# EAGLE schematic main-stm-02.2 (EAGLE 7.6.0)
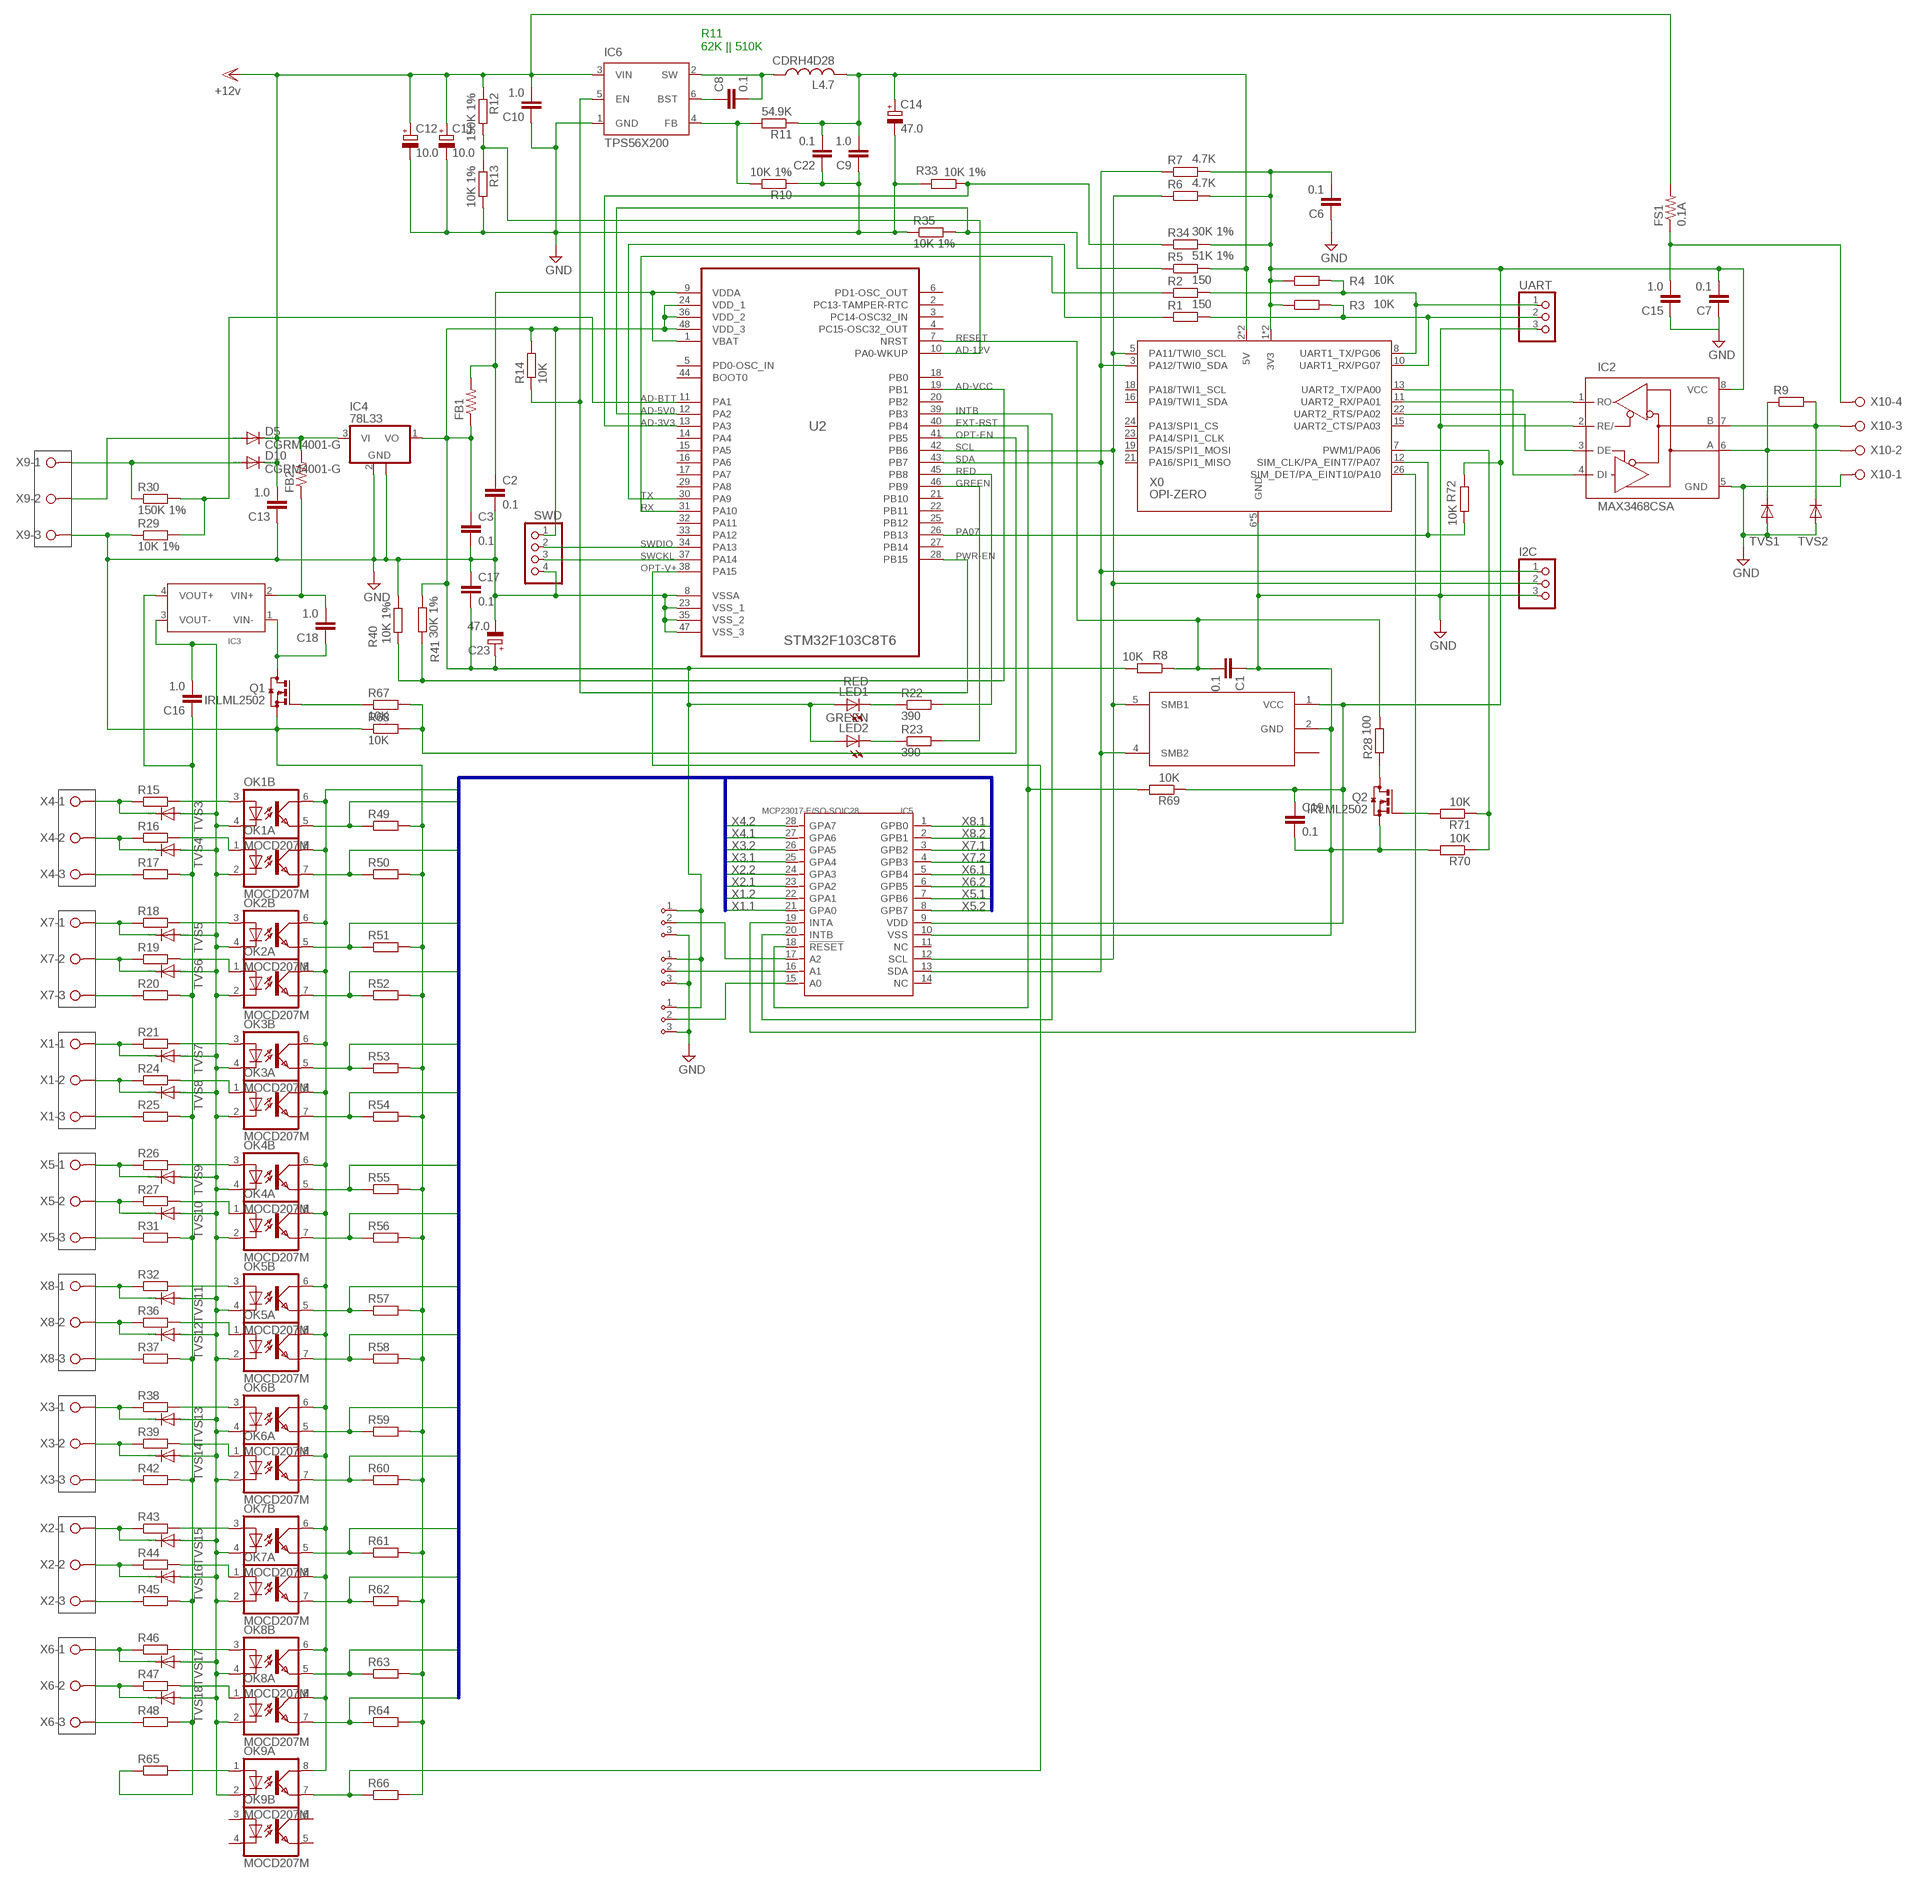
[diagram p0: schematic, sheet 1]

## Parts
A0  ADDR3PIN0603  [0603-3PIN]
A1  ADDR3PIN0603  [0603-3PIN]
A2  ADDR3PIN0603  [0603-3PIN]
C1  0.1  C-EUC0603  [C0603]
C2  0.1  C-EUC0603  [C0603]
C3  0.1  C-EUC0603  [C0603]
C6  0.1  C-EUC0805  [C0805]
C7  0.1  C-EUC0805  [C0805]
C8  0.1  C-EUC0805  [C0805]
C9  1.0  C-EUC0805  [C0805]
C10  1.0  C-EUC1206  [C1206]
C11  10.0  CPOL-EUC/6032-28R  [C/6032-28R]
C12  10.0  CPOL-EUC/6032-28R  [C/6032-28R]
C13  1.0  C-EUC1206  [C1206]
C14  47.0  CPOL-EUB/3528-21R  [B/3528-21R]
C15  1.0  C-EUC1206  [C1206]
C16  1.0  C-EUC1206  [C1206]
C17  0.1  C-EUC0603  [C0603]
C18  1.0  C-EUC1206  [C1206]
C19  0.1  C-EUC0603  [C0603]
C22  0.1  C-EUC0805  [C0805]
C23  47.0  CPOL-EUB/3528-21R  [B/3528-21R]
D5  CGRM4001-G  [SOD-123_MINI-SMA]
D10  CGRM4001-G  [SOD-123_MINI-SMA]
FB1  R-US_R0805  [R0805]
FB2  R-US_R1206  [R1206]
FS1  0.1A  R-US_R1210  [R1210]
I2C  PINHD-1X3  [1X03]
IC2  MAX3468CSA  [SO08]
IC3  DC-DC-CONV-4PIN-ISOLATINGMURATA-NME-05-12-SERIES  [DC-DC-MURATA-NME-05-12-SERIES]
IC4  78L33  78L05F  [SOT89]
IC5  MCP23017-E/SO-SOIC28  INTERFACE-MCP23017-E(SOIC28)  [SOIC28-1.27-17.9X7.5MM]
IC6  TPS56X200  [TSOT23-6_DDC]
IC7  LTC1694  [SOT23-5]
L4.7  CDRH4D28  [CDRH4D28]
LED1  RED  LEDCHIPLED_1206  [CHIPLED_1206]
LED2  GREEN  LEDCHIPLED_1206  [CHIPLED_1206]
OK1  MOCD207M  [SOIC08-FAIRCHILD]
OK2  MOCD207M  [SOIC08-FAIRCHILD]
OK3  MOCD207M  [SOIC08-FAIRCHILD]
OK4  MOCD207M  [SOIC08-FAIRCHILD]
OK5  MOCD207M  [SOIC08-FAIRCHILD]
OK6  MOCD207M  [SOIC08-FAIRCHILD]
OK7  MOCD207M  [SOIC08-FAIRCHILD]
OK8  MOCD207M  [SOIC08-FAIRCHILD]
OK9  MOCD207M  [SOIC08-FAIRCHILD]
Q1  IRLML2502  [SOT23]
Q2  IRLML2502  [SOT23]
R1  150  R-EU_R0603  [R0603]
R2  150  R-EU_R0603  [R0603]
R3  10K  R-EU_R0603  [R0603]
R4  10K  R-EU_R0603  [R0603]
R5  51K 1%  R-EU_R0603  [R0603]
R6  4.7K  R-EU_R0603  [R0603]
R7  4.7K  R-EU_R0603  [R0603]
R8  10K  R-EU_R0603  [R0603]
R9  R-EU_R1206  [R1206]
R10  10K 1%  R-EU_R0603  [R0603]
R11  54.9K  R-EU_R0603  [R0603]
R12  150K 1%  R-EU_R0603  [R0603]
R13  10K 1%  R-EU_R0603  [R0603]
R14  10K  R-EU_R0603  [R0603]
R15  R-EU_R0603  [R0603]
R16  R-EU_R0603  [R0603]
R17  R-EU_R0603  [R0603]
R18  R-EU_R0603  [R0603]
R19  R-EU_R0603  [R0603]
R20  R-EU_R0603  [R0603]
R21  R-EU_R0603  [R0603]
R22  390  R-EU_R0603  [R0603]
R23  390  R-EU_R0603  [R0603]
R24  R-EU_R0603  [R0603]
R25  R-EU_R0603  [R0603]
R26  R-EU_R0603  [R0603]
R27  R-EU_R0603  [R0603]
R28  100  R-EU_R0603  [R0603]
R29  10K 1%  R-EU_R0603  [R0603]
R30  150K 1%  R-EU_R0603  [R0603]
R31  R-EU_R0603  [R0603]
R32  R-EU_R0603  [R0603]
R33  10K 1%  R-EU_R0603  [R0603]
R34  30K 1%  R-EU_R0603  [R0603]
R35  10K 1%  R-EU_R0603  [R0603]
R36  R-EU_R0603  [R0603]
R37  R-EU_R0603  [R0603]
R38  R-EU_R0603  [R0603]
R39  R-EU_R0603  [R0603]
R40  10K 1%  R-EU_R0603  [R0603]
R41  30K 1%  R-EU_R0603  [R0603]
R42  R-EU_R0603  [R0603]
R43  R-EU_R0603  [R0603]
R44  R-EU_R0603  [R0603]
R45  R-EU_R0603  [R0603]
R46  R-EU_R0603  [R0603]
R47  R-EU_R0603  [R0603]
R48  R-EU_R0603  [R0603]
R49  R-EU_R0603  [R0603]
R50  R-EU_R0603  [R0603]
R51  R-EU_R0603  [R0603]
R52  R-EU_R0603  [R0603]
R53  R-EU_R0603  [R0603]
R54  R-EU_R0603  [R0603]
R55  R-EU_R0603  [R0603]
R56  R-EU_R0603  [R0603]
R57  R-EU_R0603  [R0603]
R58  R-EU_R0603  [R0603]
R59  R-EU_R0603  [R0603]
R60  R-EU_R0603  [R0603]
R61  R-EU_R0603  [R0603]
R62  R-EU_R0603  [R0603]
R63  R-EU_R0603  [R0603]
R64  R-EU_R0603  [R0603]
R65  R-EU_R0603  [R0603]
R66  R-EU_R0603  [R0603]
R67  10K  R-EU_R0603  [R0603]
R68  10K  R-EU_R0603  [R0603]
R69  10K  R-EU_R0603  [R0603]
R70  10K  R-EU_R0603  [R0603]
R71  10K  R-EU_R0603  [R0603]
R72  10K  R-EU_R0603  [R0603]
SWD  PINHD-1X4  [1X04]
TVS1  DIODE-SOD323-W  [SOD323-W]
TVS2  DIODE-SOD323-W  [SOD323-W]
TVS3  DIODE-SOD323-W  [SOD323-W]
TVS4  DIODE-SOD323-W  [SOD323-W]
TVS5  DIODE-SOD323-W  [SOD323-W]
TVS6  DIODE-SOD323-W  [SOD323-W]
TVS7  DIODE-SOD323-W  [SOD323-W]
TVS8  DIODE-SOD323-W  [SOD323-W]
TVS9  DIODE-SOD323-W  [SOD323-W]
TVS10  DIODE-SOD323-W  [SOD323-W]
TVS11  DIODE-SOD323-W  [SOD323-W]
TVS12  DIODE-SOD323-W  [SOD323-W]
TVS13  DIODE-SOD323-W  [SOD323-W]
TVS14  DIODE-SOD323-W  [SOD323-W]
TVS15  DIODE-SOD323-W  [SOD323-W]
TVS16  DIODE-SOD323-W  [SOD323-W]
TVS17  DIODE-SOD323-W  [SOD323-W]
TVS18  DIODE-SOD323-W  [SOD323-W]
U2  STM32F103C8T6  STM32F100CBT6B  [QFP50P900X900X160-48N]
UART  PINHD-1X3  [1X03]
X0  OPI-ZERO  [OPI0]
X1  W237-03P  [W237-133]
X2  W237-03P  [W237-133]
X3  W237-03P  [W237-133]
X4  W237-03P  [W237-133]
X5  W237-03P  [W237-133]
X6  W237-03P  [W237-133]
X7  W237-03P  [W237-133]
X8  W237-03P  [W237-133]
X9  W237-03P  [W237-133]
X10  W237-04P  [W237-4P]

## Nets
12V [POWER]: C10.2 C11.+ C12.+ C13.2 D5.C D10.C FB2.2 FS1.2 IC4.3(VI) IC6.3(VIN) R12.1 ; supply symbol labelled +12v
AD-3V3: R33.1 R34.1 U2.13(PA3)
AD-5V0: R5.1 R35.2 U2.12(PA2)
AD-12V: R12.2 R13.1 U2.10(PA0-WKUP)
AD-BTT: R29.2 R30.2 U2.11(PA1)
AD-VCC: R40.2 R41.1 U2.19(PB1)
EXT-RST: IC5.18(!RESET) R69.2 U2.40(PB4)
GND [POWER]: A0.3 A1.3 A2.3 C1.1 C2.2 C3.2 C6.1 C7.1 C9.1 C10.1 C11.- C12.- C13.1 C14.- C15.1 C17.1 C19.2 C22.1 C23.- I2C.3 IC2.2(RE/) IC2.5(GND) IC4.2(GND) IC4.2@1(GND) IC5.10(VSS) IC6.1(GND) IC7.2(GND) Q1.2(S) Q2.2(S) R10.1 R13.2 R29.1 R33.2 R35.1 R40.1 R49.2 R50.2 R51.2 R52.2 R53.2 R54.2 R55.2 R56.2 R57.2 R58.2 R59.2 R60.2 R61.2 R62.2 R63.2 R64.2 R66.2 R68.1 R70.2 SWD.4 TVS1.A TVS2.A U2.8(VSSA) U2.23(VSS_1) U2.35(VSS_2) U2.47(VSS_3) UART.3 X0.6(GND) X0.9(GND) X0.14(GND) X0.20(GND) X0.25(GND) X9.3 X10.1
GREEN: R23.2 U2.46(PB9)
INTA: IC5.19(INTA) X0.26(SIM_DET/PA_EINT10/PA10)
INTB: IC5.20(INTB) U2.39(PB3)
N$1: IC2.3(DE) X0.22(UART2_RTS/PA02)
N$2: IC2.1(RO) X0.11(UART2_RX/PA01)
N$3 [POWER]: C8.2 IC6.2(SW) L4.7.P$1
N$4: Q2.3(D) R28.1
N$5: Q2.1(G) R71.2
N$9: IC2.4(DI) X0.13(UART2_TX/PA00)
N$12 [POWER]: D5.A X9.2
N$14: OK1.3(B:A) R15.2
N$17: C8.1 IC6.6(BST)
N$21: IC2.6(A) R9.1 TVS1.C X10.2
N$22: IC6.4(FB) R10.2 R11.2
N$23: IC2.7(B) R9.2 TVS2.C X10.3
N$24: C15.2 FS1.1 X10.4
N$26: R15.1 TVS3.C X4.1
N$28: R16.1 TVS4.C X4.2
N$30: R17.1 X4.3
N$31 [POWER]: D10.A R30.1 X9.1
N$32: R18.1 TVS5.C X7.1
N$33: R19.1 TVS6.C X7.2
N$34: R20.1 X7.3
N$35: OK2.3(B:A) R18.2
N$36: R21.1 TVS7.C X1.1
N$39: OK3.3(B:A) R21.2
N$40: R24.1 TVS8.C X1.2
N$41: R25.1 X1.3
N$42: R26.1 TVS9.C X5.1
N$43: R27.1 TVS10.C X5.2
N$44: R31.1 X5.3
N$45: R32.1 TVS11.C X8.1
N$46: R36.1 TVS12.C X8.2
N$47: R37.1 X8.3
N$48: R38.1 TVS13.C X3.1
N$49: R39.1 TVS14.C X3.2
N$50: R42.1 X3.3
N$51: R43.1 TVS15.C X2.1
N$52: R44.1 TVS16.C X2.2
N$53: R45.1 X2.3
N$54: R46.1 TVS17.C X6.1
N$55: R47.1 TVS18.C X6.2
N$56: R48.1 X6.3
N$57: OK4.3(B:A) R26.2
N$58: OK5.3(B:A) R32.2
N$59: OK6.3(B:A) R38.2
N$60: OK7.3(B:A) R43.2
N$62: OK8.3(B:A) R46.2
N$63: C16.1 IC3.4(VOUT+) R17.2 R20.2 R25.2 R31.2 R37.2 R42.2 R45.2 R48.2 R65.1
N$65: OK1.1(A:A) R16.2
N$66: OK2.1(A:A) R19.2
N$67: OK3.1(A:A) R24.2
N$69: OK4.1(A:A) R27.2
N$70: OK5.1(A:A) R36.2
N$71: OK6.1(A:A) R39.2
N$72: OK7.1(A:A) R44.2
N$73: OK8.1(A:A) R47.2
N$74: C16.2 IC3.3(VOUT-) OK1.2(A:C) OK1.4(B:C) OK2.2(A:C) OK2.4(B:C) OK3.2(A:C) OK3.4(B:C) OK4.2(A:C) OK4.4(B:C) OK5.2(A:C) OK5.4(B:C) OK6.2(A:C) OK6.4(B:C) OK7.2(A:C) OK7.4(B:C) OK8.2(A:C) OK8.4(B:C) OK9.2(A:C) TVS3.A TVS4.A TVS5.A TVS6.A TVS7.A TVS8.A TVS9.A TVS10.A TVS11.A TVS12.A TVS13.A TVS14.A TVS15.A TVS16.A TVS17.A TVS18.A
N$75: LED1.C R22.1
N$93: OK9.1(A:A) R65.2
N$95: Q1.1(G) R67.1
N$98: C18.1 IC3.1(VIN-) Q1.3(D)
N$99 [POWER]: C18.2 FB2.1 IC3.2(VIN+)
N$116: A0.2 IC5.15(A0)
N$117: A1.2 IC5.16(A1)
N$118: A2.2 IC5.17(A2)
N$119: LED2.C R23.1
OPT-EN: R67.2 R68.2 U2.41(PB5)
OPT-V+: OK9.7(A:EMIT) R66.1 U2.38(PA15)
PA06: R70.1 R71.1 X0.7(PWM1/PA06)
PA07: R72.2 U2.26(PB13) X0.12(SIM_CLK/PA_EINT7/PA07)
PWR-EN: IC6.5(EN) R14.1 U2.28(PB15)
RED: R22.2 U2.45(PB8)
RESET: C1.2 R8.1 R28.2 U2.7(NRST)
RX: R2.1 U2.31(PA10)
SCL: I2C.2 IC5.12(SCL) IC7.5(SMB1) R6.1 U2.42(PB6) X0.5(PA11/TWI0_SCL)
SDA: I2C.1 IC5.13(SDA) IC7.4(SMB2) R7.1 U2.43(PB7) X0.3(PA12/TWI0_SDA)
SWCKL: SWD.3 U2.37(PA14)
SWDIO: SWD.2 U2.34(PA13)
TX: R1.1 U2.30(PA9)
VCC [POWER]: A0.1 A1.1 A2.1 C3.1 C17.2 C23.+ FB1.1 IC4.1(VO) LED1.A LED2.A R8.2 R14.2 R41.2 SWD.1 U2.24(VDD_1) U2.36(VDD_2) U2.48(VDD_3)
VDDA: C2.1 FB1.2 U2.1(VBAT) U2.9(VDDA)
X1.1: IC5.21(GPA0) OK3.5(B:EMIT) R53.1
X1.2: IC5.22(GPA1) OK3.7(A:EMIT) R54.1
X2.1: IC5.23(GPA2) OK7.5(B:EMIT) R61.1
X2.2: IC5.24(GPA3) OK7.7(A:EMIT) R62.1
X3.1: IC5.25(GPA4) OK6.5(B:EMIT) R59.1
X3.2: IC5.26(GPA5) OK6.7(A:EMIT) R60.1
X4.1: IC5.27(GPA6) OK1.5(B:EMIT) R49.1
X4.2: IC5.28(GPA7) OK1.7(A:EMIT) R50.1
X5.1: IC5.7(GPB6) OK4.5(B:EMIT) R55.1
X5.2: IC5.8(GPB7) OK4.7(A:EMIT) R56.1
X6.1: IC5.5(GPB4) OK8.5(B:EMIT) R63.1
X6.2: IC5.6(GPB5) OK8.7(A:EMIT) R64.1
X7.1: IC5.3(GPB2) OK2.5(B:EMIT) R51.1
X7.2: IC5.4(GPB3) OK2.7(A:EMIT) R52.1
X8.1: IC5.1(GPB0) OK5.5(B:EMIT) R57.1
X8.2: IC5.2(GPB1) OK5.7(A:EMIT) R58.1
Z3V3 [POWER]: C6.2 C7.2 C19.1 IC2.8(VCC) IC5.9(VDD) IC7.1(VCC) OK1.6(B:COL) OK1.8(A:COL) OK2.6(B:COL) OK2.8(A:COL) OK3.6(B:COL) OK3.8(A:COL) OK4.6(B:COL) OK4.8(A:COL) OK5.6(B:COL) OK5.8(A:COL) OK6.6(B:COL) OK6.8(A:COL) OK7.6(B:COL) OK7.8(A:COL) OK8.6(B:COL) OK8.8(A:COL) OK9.8(A:COL) R3.1 R4.1 R6.2 R7.2 R34.2 R69.1 R72.1 X0.1(3V3) X0.17(3V3)
Z5V [POWER]: C9.2 C14.+ C22.2 L4.7.P$2 R5.2 R11.1 X0.2(5V) X0.4(5V)
ZRX: R1.2 R3.2 UART.2 X0.10(UART1_RX/PG07)
ZTX: R2.2 R4.2 UART.1 X0.8(UART1_TX/PG06)
Unconnected: IC5.11(NC) IC5.14(NC) IC7.3(NC) OK9.3(B:A) OK9.4(B:C) OK9.5(B:EMIT) OK9.6(B:COL) U2.2(PC13-TAMPER-RTC) U2.3(PC14-OSC32_IN) U2.4(PC15-OSC32_OUT) U2.5(PD0-OSC_IN) U2.6(PD1-OSC_OUT) U2.14(PA4) U2.15(PA5) U2.16(PA6) U2.17(PA7) U2.18(PB0) U2.20(PB2) U2.21(PB10) U2.22(PB11) U2.25(PB12) U2.27(PB14) U2.29(PA8) U2.32(PA11) U2.33(PA12) U2.44(BOOT0) X0.15(UART2_CTS/PA03) X0.16(PA19/TWI1_SDA) X0.18(PA18/TWI1_SCL) X0.19(PA15/SPI1_MOSI) X0.21(PA16/SPI1_MISO) X0.23(PA14/SPI1_CLK) X0.24(PA13/SPI1_CS)

## Buses
B$1

## Notes on the sheet
- R11
  62K || 510K

## Library data of the parts
A0 A1 A2 = components:ADDR3PIN
C1-C3 C6-C10 C13 C15-C19 C22 = rcl:C-EU: CAPACITOR, European symbol
C11 C12 C14 C23 = rcl:CPOL-EU: POLARIZED CAPACITOR, European symbol
D5 D10 = diode:CGRM400*-G: Molded plasitc,JEDEC SOD-123/Mini SMA Source: Comchip CGRM4001-G.pdf
FB1 FB2 FS1 = rcl:R-US_: RESISTOR, American symbol
I2C UART = pinhead:PINHD-1X3: PIN HEADER
IC2 = maxim:MAX34*: +5V, Fail-Safe, 40Mbps, Profibus RS-485/RS-422 Transceivers Source: MAX3465-MAX3469.pdf; MPN: MAX3468CSA+; OC_FARNELL: unknown; OC_NEWARK: 76K6721
IC3 = SteveMarple:DC-DC-CONV-4PIN-ISOLATING
IC4 = linear:78L*: POSITOIV-VOLTAGE REGULATORS Output up to 100 mA Source: Datasheet <http://focus.ti.com/lit/ds/symlink/ua78l05.pdf>
IC5 = Seeed-OPL-ic:INTERFACE-MCP23017-E(SOIC28): 310070050; MPN: MCP23017-E/SO
IC6 = custom:TPS56X200
IC7 = components:LTC1694: Dual SMBus active pull-up
L4.7 = custom:CDRH4D28
LED1 LED2 = led:LED: LED OSRAM: - CHIPLED LG R971, LG N971, LY N971, LG Q971, LY Q971, LO R971, LY R971 LH N974, LH R974 LS Q976, LO Q976, LY Q976 LO Q996 - Hyper CHIPLED LW Q18S LB Q993, LB Q99A, LB R99A - SideLED LS A670, LO A670, LY A670, LG A670, LP A670 LB A673, LV A673, LT A673, LW A673 LH A674 LY A675 LS A676, LA A676, LO A676, LY A676, LW A676 LS A679, LY A679, LG A679 - Hyper Micro SIDELED® LS Y876, LA Y876, LO Y876, LY Y876 LT Y87S - SmartLED LW L88C, LW L88S LB L89C, LB L89S, LG L890 LS L89K, LO L89K, LY L89K LS L896, LA L896, LO L896, LY L896 - TOPLED LS T670, LO T670, LY T670, LG T670, LP T670 LSG T670, LSP T670, LSY T670, LOP T670, LYG T670 LG T671, LOG T671, LSG T671 LB T673, LV T673, LT T673, LW T673 LH T674 LS T676, LA T676, LO T676, LY T676, LB T676, LH T676, LSB T676, LW T676 LB T67C, LV T67C, LT T67C, LS T67K, LO T67K, LY T67K, LW E67C LS E67B, LA E67B, LO E67B, LY E67B, LB E67C, LV E67C, LT E67C LW T67C LS T679, LY T679, LG T679 LS T770, LO T770, LY T770, LG T770, LP T770 LB T773, LV T773, LT T773, LW T773 LH T774 LS E675, LA E675, LY E675, LS T675 LS T776, LA T776, LO T776, LY T776, LB T776 LHGB T686 LT T68C, LB T68C - Hyper Mini TOPLED® LB M676 - Mini TOPLED Santana® LG M470 LS M47K, LO M47K, LY M47K Source: http://www.osram.convergy.de LUXEON: - LUMILED® LXK2-PW12-R00, LXK2-PW12-S00, LXK2-PW14-U00, LXK2-PW14-V00 LXK2-PM12-R00, LXK2-PM12-S00, LXK2-PM14-U00 LXK2-PE12-Q00, LXK2-PE12-R00, LXK2-PE12-S00, LXK2-PE14-T00, LXK2-PE14-U00 LXK2-PB12-K00, LXK2-PB12-L00, LXK2-PB12-M00, LXK2-PB14-N00, LXK2-PB14-P00, LXK2-PB14-Q00 LXK2-PR12-L00, LXK2-PR12-M00, LXK2-PR14-Q00, LXK2-PR14-R00 LXK2-PD12-Q00, LXK2-PD12-R00, LXK2-PD12-S00 LXK2-PH12-R00, LXK2-PH12-S00 LXK2-PL12-P00, LXK2-PL12-Q00, LXK2-PL12-R00 Source: www.luxeon.com KINGBRIGHT: KA-3528ASYC Source: www.kingbright.com
OK1-OK9 = optocoupler:MOCD20*M: MOCD207M, MOCD208M Dual Channel Phototransistor Small Outline Surface Mount Optocouplers Source: Data sheet <http://www.fairchildsemi.com/ds/MO%2FMOCD207-M.pdf>; MF: FAIRCHILD SEMICONDUCTOR; MPN: MOCD207-M; OC_FARNELL: 1623297; OC_NEWARK: 67K0803
Q1 Q2 = components:IRLML2502: N-CHANNEL MOS FET
R1-R72 = rcl:R-EU_: RESISTOR, European symbol
SWD = pinhead:PINHD-1X4: PIN HEADER
TVS1-TVS18 = diode:DIODE-: DIODE
U2 = ST Microelctronics_By_element14_Batch_1:STM32F100CBT6B: ARM-based 32-bit MCU; MPN: STM32F100CBT6B; OC_FARNELL: 1838512; OC_NEWARK: 86R1308; PACKAGE: LQFP-48; SUPPLIER: STMircroelectronics
X0 = OrangePi0:OPI-ZERO: Orange Pi Zero Footprint. Only 2x13 pin header. -- UNTESTED!
X1-X9 = con-wago-508:W237-03P: WAGO SREW CLAMP; OC_FARNELL: unknown; OC_NEWARK: unknown
X10 = con-wago-508:W237-04P: WAGO SREW CLAMP; OC_FARNELL: unknown; OC_NEWARK: unknown

## Net classes
0 default: width 0.254 mm, clearance 0.254 mm
1 POWER: width 0.508 mm, clearance 0.254 mm
2 HV: width 1.27 mm, clearance 1.27 mm